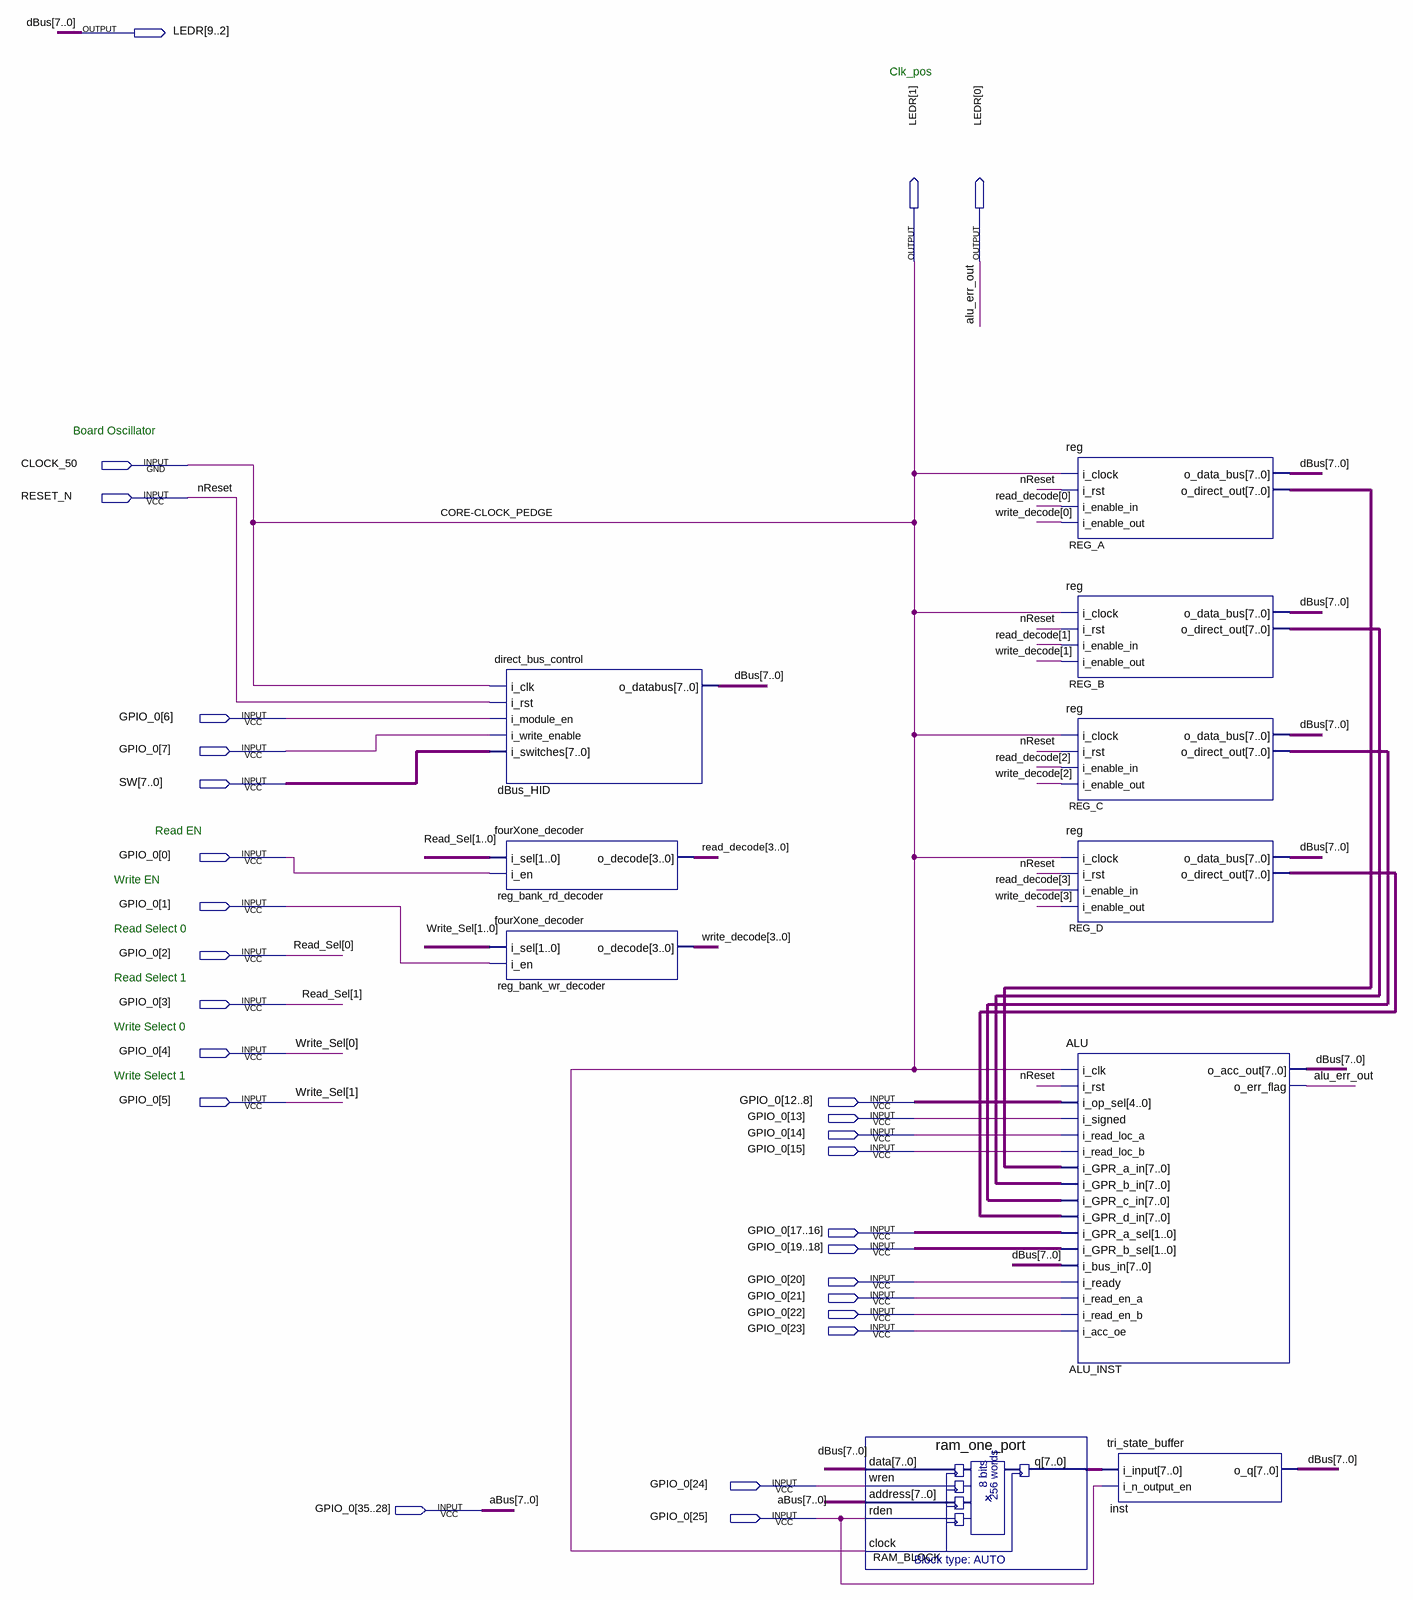
[diagram p0: schematic sheet]
// Quartus schematic Nx8.bdf as structural Verilog: 10 symbols, 27 pins
module Nx8 (
  input  CLOCK_50,
  input  RESET_N,
  input  [35:0] GPIO_0,
  input  [7:0] SW,
  output [9:0] LEDR
);

  wire [3:0] read_decode, write_decode;
  wire [7:0] RAM_BLOCK_q, REG_A_o_direct_out, REG_B_o_direct_out, REG_C_o_direct_out, REG_D_o_direct_out;

  direct_bus_control dBus_HID (
    .i_clk(CLOCK_50), .i_rst(RESET_N), .i_module_en(GPIO_0[6]), .i_write_enable(GPIO_0[7]), .i_switches(SW),
    .o_databus(LEDR[9:2]));
  fourXone_decoder reg_bank_rd_decoder (.i_sel(GPIO_0[3:2]), .i_en(GPIO_0[0]), .o_decode(read_decode));
  fourXone_decoder reg_bank_wr_decoder (.i_sel(GPIO_0[5:4]), .i_en(GPIO_0[1]), .o_decode(write_decode));
  ram_one_port RAM_BLOCK (
    .data(LEDR[9:2]), .wren(GPIO_0[24]), .address(GPIO_0[35:28]), .rden(GPIO_0[25]), .clock(CLOCK_50),
    .q(RAM_BLOCK_q));
  \reg  REG_A (
    .i_clock(CLOCK_50), .i_rst(RESET_N), .i_enable_in(read_decode[0]), .i_enable_out(write_decode[0]),
    .o_direct_out(REG_A_o_direct_out), .o_data_bus(LEDR[9:2]));
  \reg  REG_B (
    .i_clock(CLOCK_50), .i_rst(RESET_N), .i_enable_in(read_decode[1]), .i_enable_out(write_decode[1]),
    .o_direct_out(REG_B_o_direct_out), .o_data_bus(LEDR[9:2]));
  \reg  REG_C (
    .i_clock(CLOCK_50), .i_rst(RESET_N), .i_enable_in(read_decode[2]), .i_enable_out(write_decode[2]),
    .o_direct_out(REG_C_o_direct_out), .o_data_bus(LEDR[9:2]));
  \reg  REG_D (
    .i_clock(CLOCK_50), .i_rst(RESET_N), .i_enable_in(read_decode[3]), .i_enable_out(write_decode[3]),
    .o_direct_out(REG_D_o_direct_out), .o_data_bus(LEDR[9:2]));
  ALU ALU_INST (
    .i_clk(CLOCK_50), .i_rst(RESET_N), .i_op_sel(GPIO_0[12:8]), .i_signed(GPIO_0[13]),
    .i_read_loc_a(GPIO_0[14]), .i_read_loc_b(GPIO_0[15]), .i_GPR_a_in(REG_A_o_direct_out),
    .i_GPR_b_in(REG_B_o_direct_out), .i_GPR_c_in(REG_C_o_direct_out), .i_GPR_d_in(REG_D_o_direct_out),
    .i_GPR_a_sel(GPIO_0[17:16]), .i_GPR_b_sel(GPIO_0[19:18]), .i_bus_in(LEDR[9:2]), .i_ready(GPIO_0[20]),
    .i_read_en_a(GPIO_0[21]), .i_read_en_b(GPIO_0[22]), .i_acc_oe(GPIO_0[23]), .o_acc_out(LEDR[9:2]),
    .o_err_flag(LEDR[0]));
  tri_state_buffer inst (.i_input(RAM_BLOCK_q), .i_n_output_en(GPIO_0[25]), .o_q(LEDR[9:2]));

  assign LEDR[1] = CLOCK_50;

  // Other names for the same wires on the sheet: aBus[7:0] = GPIO_0[35:28]; alu_err_out = LEDR[0];
  //   dBus[7:0] = LEDR[9:2]; CORE-CLOCK_PEDGE = CLOCK_50; nReset = RESET_N; Read_Sel[1:0] = GPIO_0[3:2];
  //   Write_Sel[1:0] = GPIO_0[5:4]

  // Notes on the sheet:
  //   Clk_pos
  //   Board Oscillator
  //   Read EN
  //   Write EN
  //   Read Select 0
  //   Read Select 1
  //   Write Select 0
  //   Write Select 1
endmodule
